# EAGLE design icyradio-exp-template (EAGLE 9.6.2)
CREVISION: 1; DESIGNER: Joao Silva
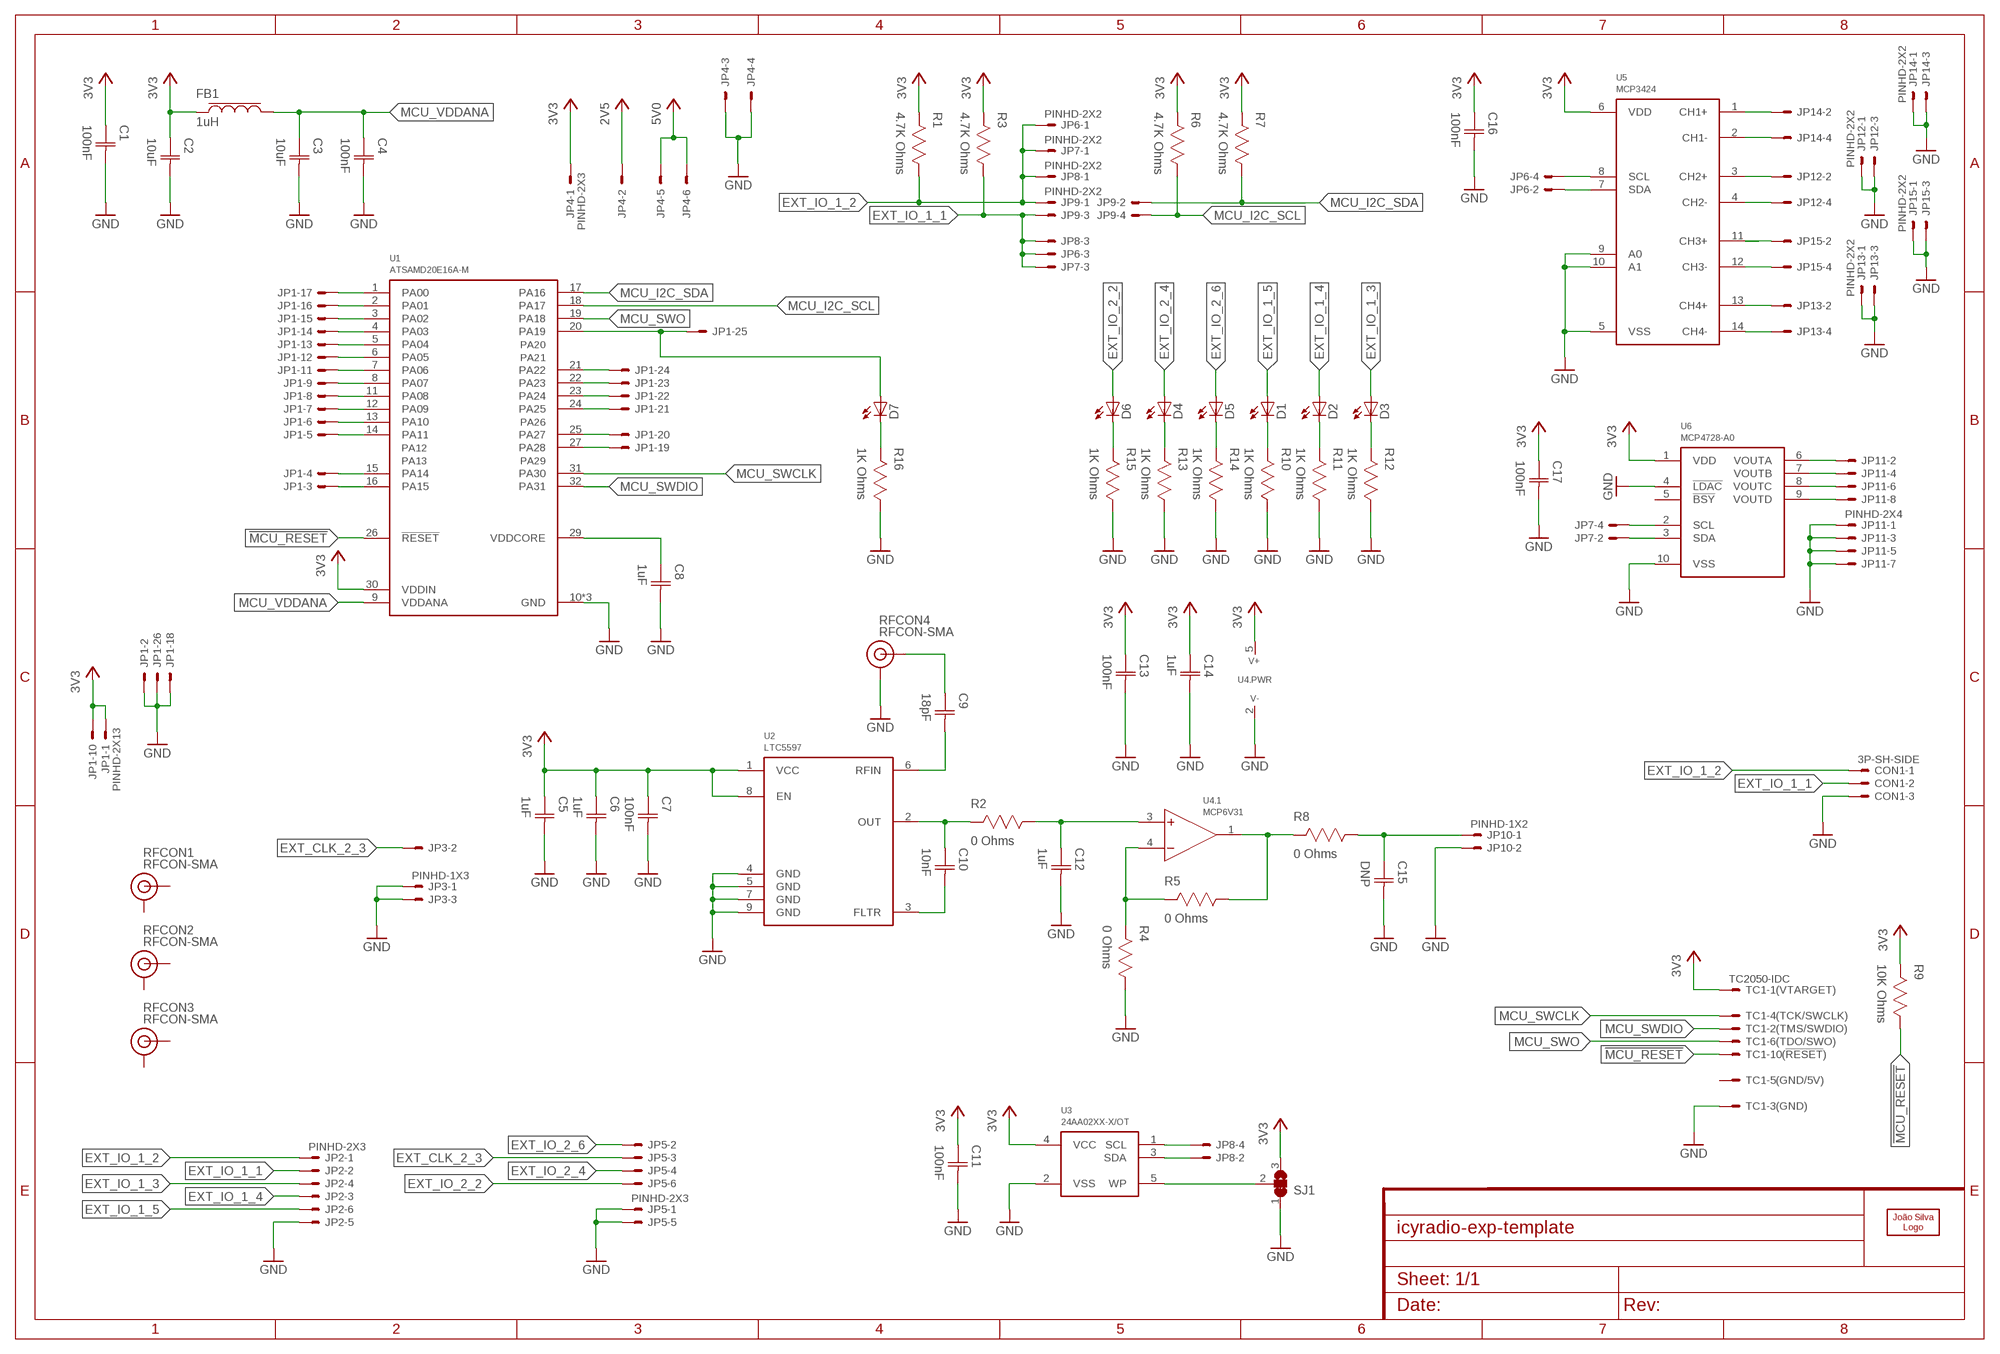
[diagram p0: schematic, sheet 1]

## Parts
C1  100nF  CAPACITOR-0402  [CAP0402]
C2  10uF  CAPACITOR-0402  [CAP0402]
C3  10uF  CAPACITOR-0402  [CAP0402]
C4  100nF  CAPACITOR-0402  [CAP0402]
C5  1uF  CAPACITOR-0402  [CAP0402]
C6  1uF  CAPACITOR-0402  [CAP0402]
C7  100nF  CAPACITOR-0402  [CAP0402]
C8  1uF  CAPACITOR-0402  [CAP0402]
C9  18pF  CAPACITOR-0402  [CAP0402]
C10  10nF  CAPACITOR-0402  [CAP0402]
C11  100nF  CAPACITOR-0402  [CAP0402]
C12  1uF  CAPACITOR-0402  [CAP0402]
C13  100nF  CAPACITOR-0402  [CAP0402]
C14  1uF  CAPACITOR-0402  [CAP0402]
C15  DNP  CAPACITOR-0402  [CAP0402]
C16  100nF  CAPACITOR-0402  [CAP0402]
C17  100nF  CAPACITOR-0402  [CAP0402]
CON1  3P-SH-SIDE  [SH-03-SIDE]
D1  LED0603  [0603]
D2  LED0603  [0603]
D3  LED0603  [0603]
D4  LED0603  [0603]
D5  LED0603  [0603]
D6  LED0603  [0603]
D7  LED0603  [0603]
FB1  1uH  FERRITE-0603  [IND0603]
JP1  PINHD-2X13  [2X13]
JP2  PINHD-2X3  [2X03]
JP3  PINHD-1X3  [1X03]
JP4  PINHD-2X3  [2X03]
JP5  PINHD-2X3  [2X03]
JP6  PINHD-2X2  [2X02]
JP7  PINHD-2X2  [2X02]
JP8  PINHD-2X2  [2X02]
JP9  PINHD-2X2  [2X02]
JP10  PINHD-1X2  [1X02]
JP11  PINHD-2X4  [2X04]
JP12  PINHD-2X2  [2X02]
JP13  PINHD-2X2  [2X02]
JP14  PINHD-2X2  [2X02]
JP15  PINHD-2X2  [2X02]
LOGO1  JSILVA-5MM  [JSILVA_5MM]
R1  4.7K Ohms  RESISTOR-0402  [RES0402]
R2  0 Ohms  RESISTOR-0402  [RES0402]
R3  4.7K Ohms  RESISTOR-0402  [RES0402]
R4  0 Ohms  RESISTOR-0402  [RES0402]
R5  0 Ohms  RESISTOR-0402  [RES0402]
R6  4.7K Ohms  RESISTOR-0402  [RES0402]
R7  4.7K Ohms  RESISTOR-0402  [RES0402]
R8  0 Ohms  RESISTOR-0402  [RES0402]
R9  10K Ohms  RESISTOR-0402  [RES0402]
R10  1K Ohms  RESISTOR-0402  [RES0402]
R11  1K Ohms  RESISTOR-0402  [RES0402]
R12  1K Ohms  RESISTOR-0402  [RES0402]
R13  1K Ohms  RESISTOR-0402  [RES0402]
R14  1K Ohms  RESISTOR-0402  [RES0402]
R15  1K Ohms  RESISTOR-0402  [RES0402]
R16  1K Ohms  RESISTOR-0402  [RES0402]
RFCON1  RFCON-SMA  [SMA]
RFCON2  RFCON-SMA  [SMA]
RFCON3  RFCON-SMA  [SMA]
RFCON4  RFCON-SMA  [SMA]
SJ1  SJ2CS  [SJ2C_S]
TC1  TC2050-IDC  [TC2050-IDC]
U1  ATSAMD20E16A-M  [QFN32]
U2  LTC5597  [DFN8_2X2]
U3  24AA02XX-X/OT  [SOT23-5]
U4  MCP6V31  [SOT23-5]
U5  MCP3424  [TSSOP14]
U6  MCP4728-A0  [MSOP10]

## Nets
2V5: JP4.2
3V3: C1.1(C1) C2.1(C1) C5.1(C1) C6.1(C1) C7.1(C1) C11.1(C1) C13.1(C1) C14.1(C1) C16.1(C1) C17.1(C1) FB1.1 JP1.1 JP1.10 JP4.1 R1.2 R3.2 R6.2 R7.2 R9.2 SJ1.3 TC1.1 U1.30(VDDIN) U2.1(VCC) U2.8(EN) U3.4(VCC) U4.5(.PWR:V+) U5.6(VDD) U6.1(VDD)
5V0: JP4.5 JP4.6
!MCU_RESET: R9.1 TC1.10 U1.26(!RESET)
ADC_C1_N: JP14.4 U5.2(CH1-)
ADC_C1_P: JP14.2 U5.1(CH1+)
ADC_C2_N: JP12.4 U5.4(CH2-)
ADC_C2_P: JP12.2 U5.3(CH2+)
ADC_C3_N: JP15.4 U5.12(CH3-)
ADC_C3_P: JP15.2 U5.11(CH3+)
ADC_C4_N: JP13.4 U5.14(CH4-)
ADC_C4_P: JP13.2 U5.13(CH4+)
ADC_I2C_SCL: JP6.4 U5.8(SCL)
ADC_I2C_SDA: JP6.2 U5.7(SDA)
DAC_I2C_SCL: JP7.4 U6.2(SCL)
DAC_I2C_SDA: JP7.2 U6.3(SDA)
DAC_VA: JP11.2 U6.6(VOUTA)
DAC_VB: JP11.4 U6.7(VOUTB)
DAC_VC: JP11.6 U6.8(VOUTC)
DAC_VD: JP11.8 U6.9(VOUTD)
EE_I2C_SCL: JP8.4 U3.1(SCL)
EE_I2C_SDA: JP8.2 U3.3(SDA)
EE_WP: SJ1.2 U3.5(WP)
EXT_CLK_2_3 [CPWG 50 Ohm Single-Ended]: JP3.2 JP5.3
EXT_IO_1_1: CON1.2 JP2.2 JP6.3 JP7.3 JP8.3 JP9.3 R3.1
EXT_IO_1_2: CON1.1 JP2.1 JP6.1 JP7.1 JP8.1 JP9.1 R1.1
EXT_IO_1_3: D3.A JP2.4
EXT_IO_1_4: D2.A JP2.3
EXT_IO_1_5: D1.A JP2.6
EXT_IO_2_2: D6.A JP5.6
EXT_IO_2_4: D4.A JP5.4
EXT_IO_2_6: D5.A JP5.2
GND: C1.2(C2) C2.2(C2) C3.2(C2) C4.2(C2) C5.2(C2) C6.2(C2) C7.2(C2) C8.2(C2) C11.2(C2) C12.2(C2) C13.2(C2) C14.2(C2) C15.2(C2) C16.2(C2) C17.2(C2) CON1.3 JP1.2 JP1.18 JP1.26 JP2.5 JP3.1 JP3.3 JP4.3 JP4.4 JP5.1 JP5.5 JP10.2 JP11.1 JP11.3 JP11.5 JP11.7 JP12.1 JP12.3 JP13.1 JP13.3 JP14.1 JP14.3 JP15.1 JP15.3 R4.1 R10.1 R11.1 R12.1 R13.1 R14.1 R15.1 R16.1 RFCON4.GND@0(GND) RFCON4.GND@1(GND) RFCON4.GND@2(GND) RFCON4.GND@3(GND) SJ1.1 TC1.3 U1.10(GND) U1.28(GND) U1.33(GND) U2.4(GND) U2.5(GND) U2.7(GND) U2.9(GND) U3.2(VSS) U4.2(.PWR:V-) U5.5(VSS) U5.9(A0) U5.10(A1) U6.4(!LDAC) U6.10(VSS)
MCU_I2C_SCL: JP9.4 R6.1 U1.18(PA17)
MCU_I2C_SDA: JP9.2 R7.1 U1.17(PA16)
MCU_SWCLK: TC1.4 U1.31(PA30)
MCU_SWDIO: TC1.2 U1.32(PA31)
MCU_SWO: TC1.6 U1.19(PA18)
MCU_VDDANA: C3.1(C1) C4.1(C1) FB1.2 U1.9(VDDANA)
N$1: C8.1(C1) U1.29(VDDCORE)
N$2: D1.C R10.2
N$3: D2.C R11.2
N$4: D3.C R12.2
N$5: D4.C R13.2
N$6: D5.C R14.2
N$7: D6.C R15.2
N$8: D7.C R16.2
N$14: R5.1 R8.2 U4.1(.1:OUT)
N$15: C10.2(C2) U2.3(FLTR)
N$16: C10.1(C1) R2.2 U2.2(OUT)
N$17: C12.1(C1) R2.1 U4.3(.1:+IN)
N$18: R4.2 R5.2 U4.4(.1:-IN)
N$19: C9.1(C1) RFCON4.SIGNAL
N$20: C9.2(C2) U2.6(RFIN)
N$21: C15.1(C1) JP10.1 R8.1
P0: JP1.17 U1.1(PA00)
P1: JP1.16 U1.2(PA01)
P2: JP1.15 U1.3(PA02)
P3: JP1.14 U1.4(PA03)
P4: JP1.13 U1.5(PA04)
P5: JP1.12 U1.6(PA05)
P6: JP1.11 U1.7(PA06)
P7: JP1.9 U1.8(PA07)
P8: JP1.8 U1.11(PA08)
P9: JP1.7 U1.12(PA09)
P10: JP1.6 U1.13(PA10)
P11: JP1.5 U1.14(PA11)
P14: JP1.4 U1.15(PA14)
P15: JP1.3 U1.16(PA15)
P19: D7.A JP1.25 U1.20(PA19)
P22: JP1.24 U1.21(PA22)
P23: JP1.23 U1.22(PA23)
P24: JP1.22 U1.23(PA24)
P25: JP1.21 U1.24(PA25)
P27: JP1.20 U1.25(PA27)
P28: JP1.19 U1.27(PA28)
Unconnected: RFCON1.GND@0(GND) RFCON1.GND@1(GND) RFCON1.GND@2(GND) RFCON1.GND@3(GND) RFCON1.SIGNAL RFCON2.GND@0(GND) RFCON2.GND@1(GND) RFCON2.GND@2(GND) RFCON2.GND@3(GND) RFCON2.SIGNAL RFCON3.GND@0(GND) RFCON3.GND@1(GND) RFCON3.GND@2(GND) RFCON3.GND@3(GND) RFCON3.SIGNAL TC1.5 TC1.7 TC1.8 TC1.9 U6.5(!BSY)

## Library data of the parts
C1-C17 = Capacitor:CAPACITOR
CON1 = JST:3P: Disconnectable Crimp style connector, 1.0mm pitch 3 contacts
D1-D7 = LED:LED
FB1 = Inductor:FERRITE
JP1 = Pin Header:PINHD-2X13: PIN HEADER
JP2 JP4 JP5 = Pin Header:PINHD-2X3: PIN HEADER
JP3 = Pin Header:PINHD-1X3: PIN HEADER
JP6-JP9 JP12-JP15 = Pin Header:PINHD-2X2: PIN HEADER
JP10 = Pin Header:PINHD-1X2: PIN HEADER
JP11 = Pin Header:PINHD-2X4: PIN HEADER
LOGO1 = Silkscreen:JS
R1-R16 = Resistor:RESISTOR
RFCON1-RFCON4 = RF Connector:RFCON
SJ1 = Solder Jumper:SJ2C
TC1 = TagConnect:TC2050-IDC
U1 = Microchip:ATSAMD2*-?
U2 = Analog Devices:LTC5597
U3 = Microchip:24AA02
U4 = Microchip:MCP6V31
U5 = Microchip:MCP3424
U6 = Microchip:MCP4728-A*

## Net classes
1 CPWG 50 Ohm Single-Ended: width 0.2 mm, clearance 0.127 mm to class 0, clearance 0.127 mm

## Board
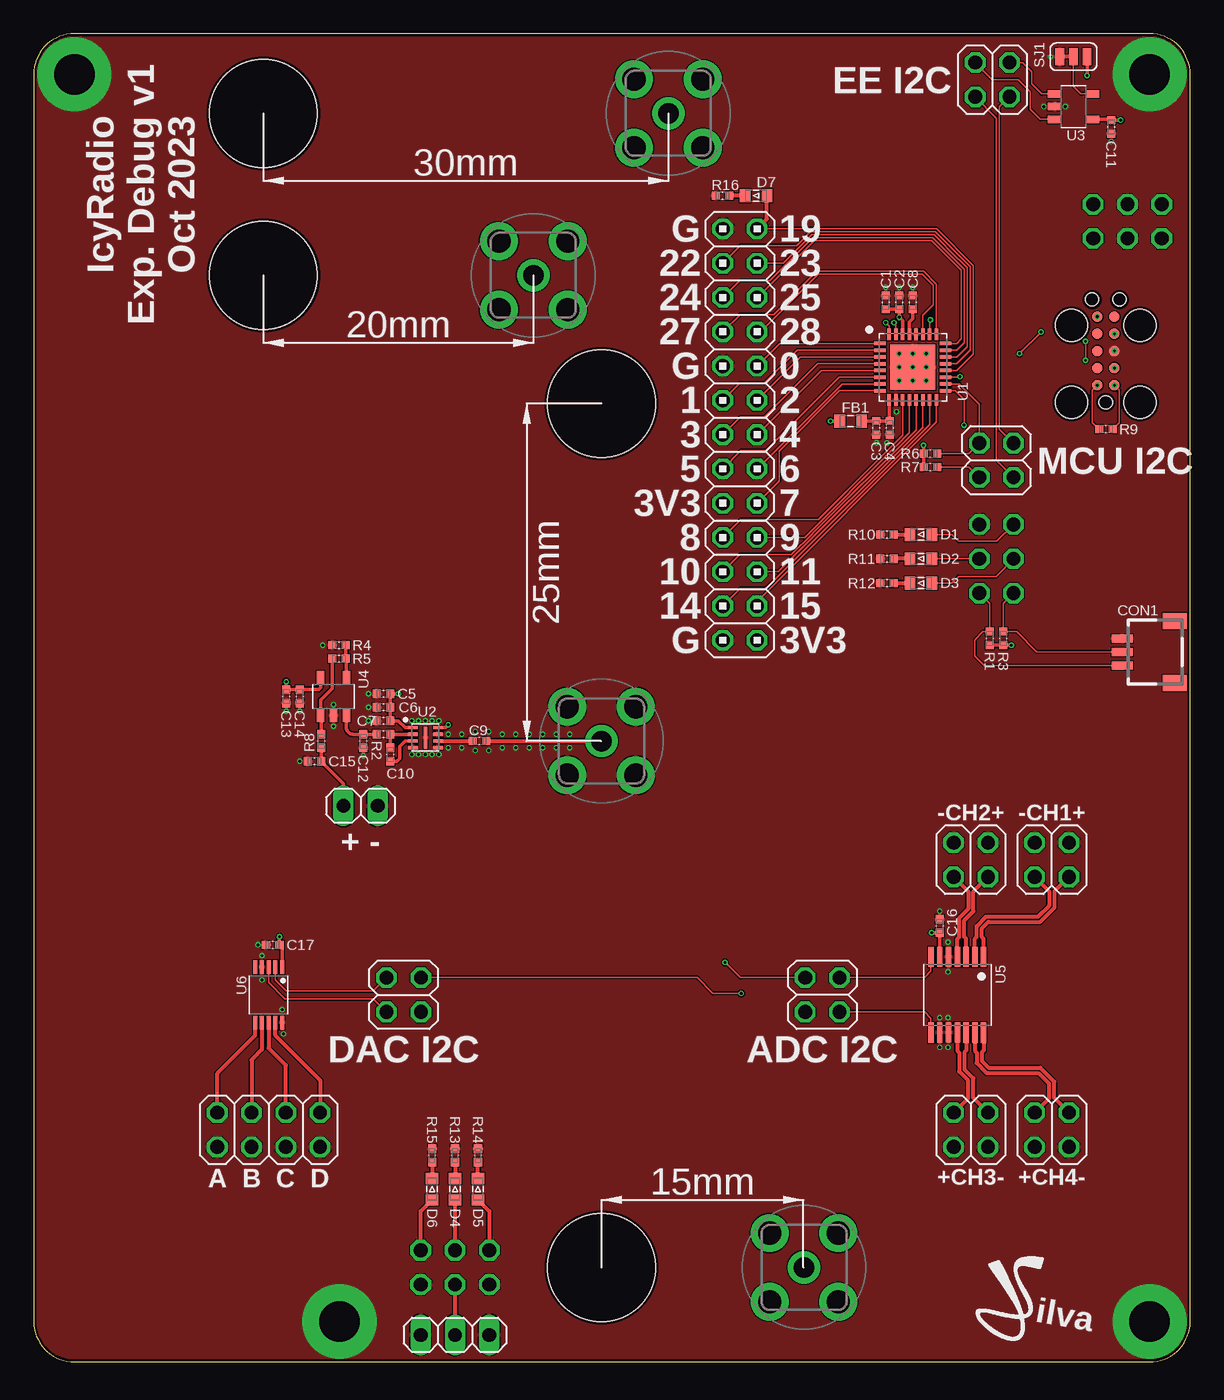
[diagram p1: board, top side]
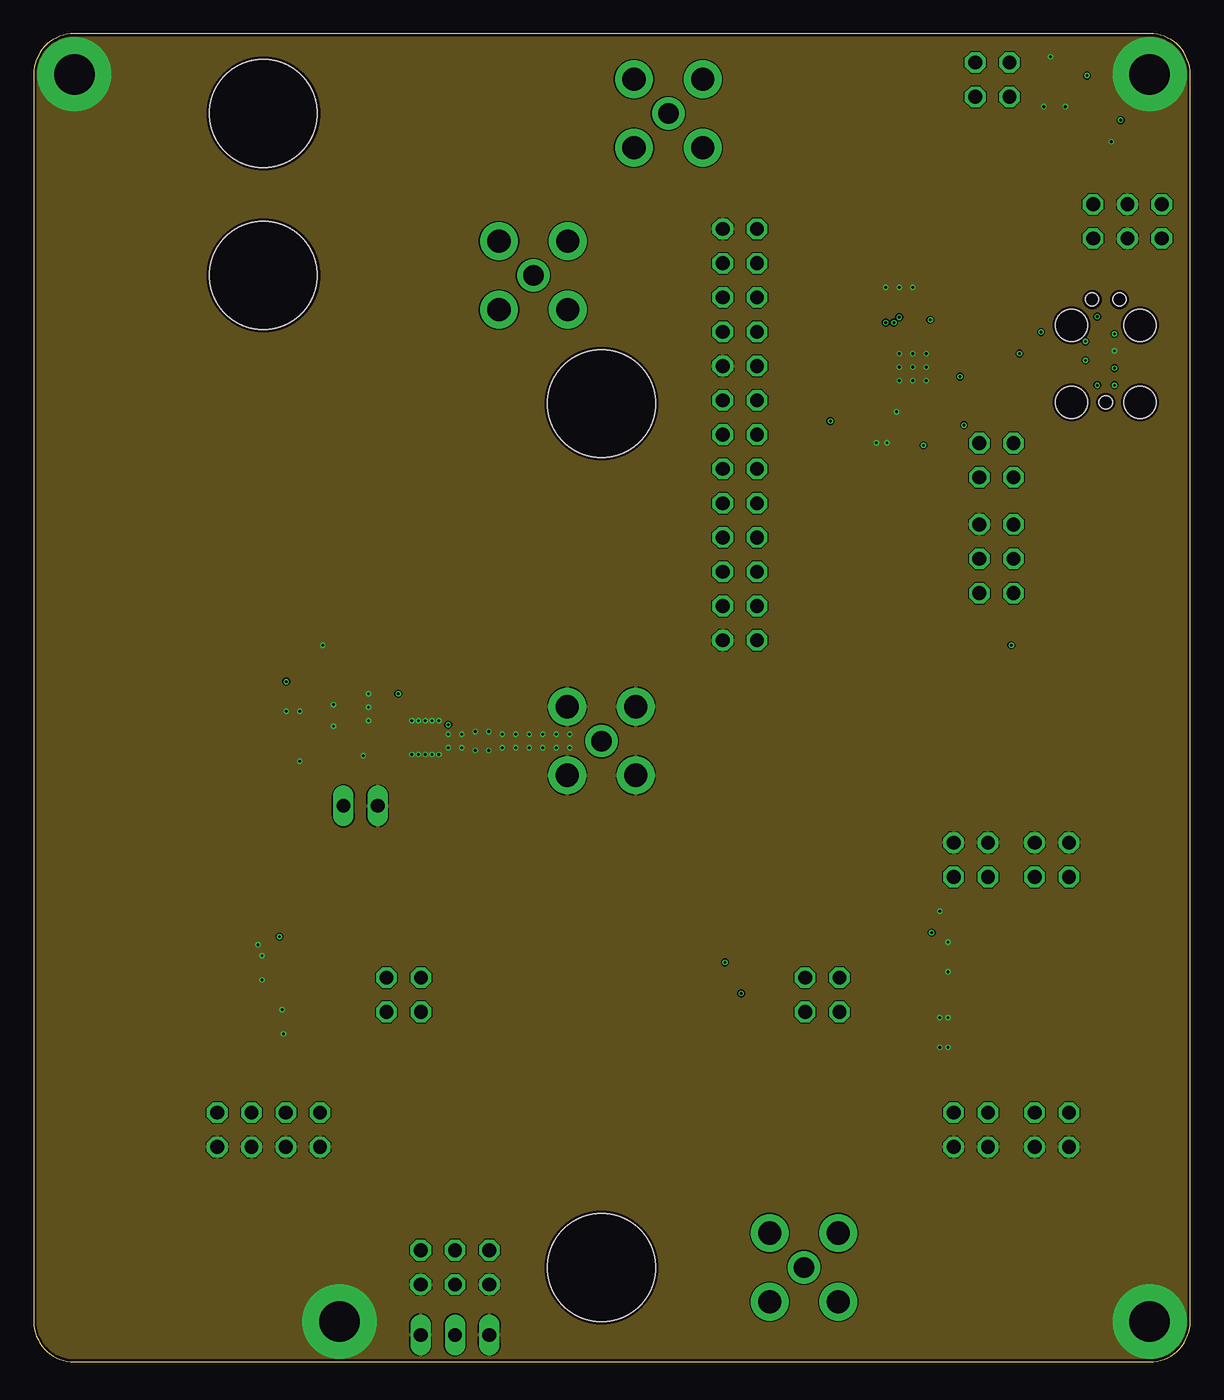
[diagram p2: board, inner layer Route2]
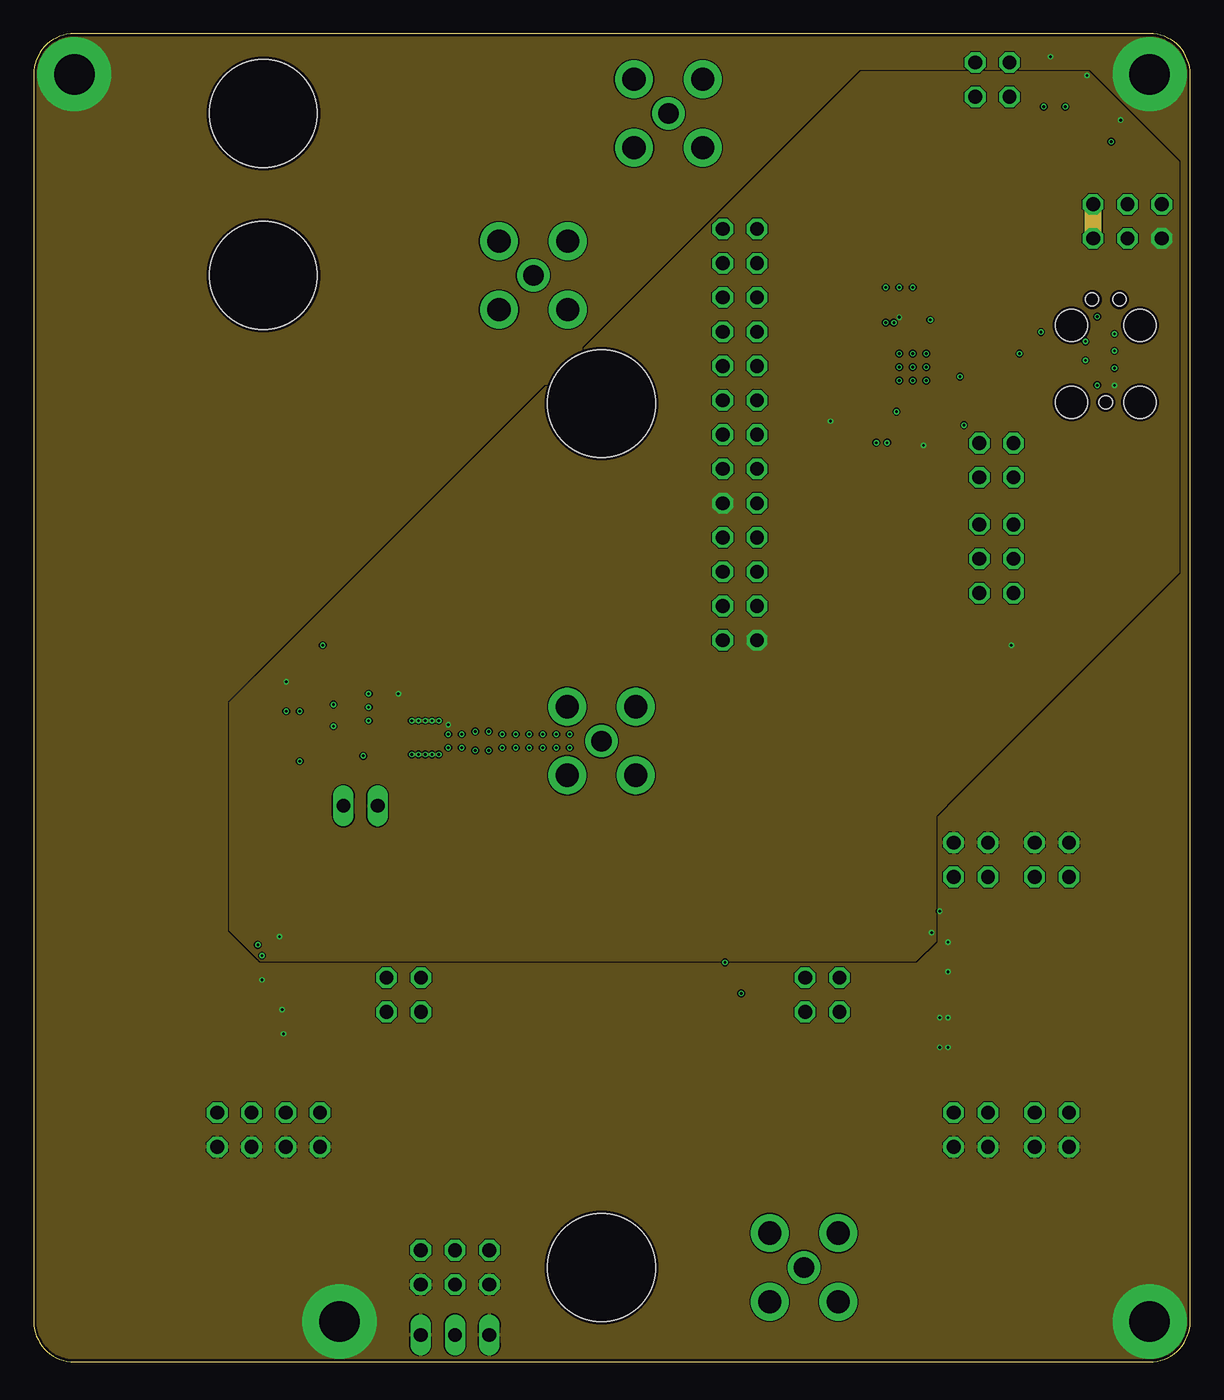
[diagram p3: board, inner layer Route15]
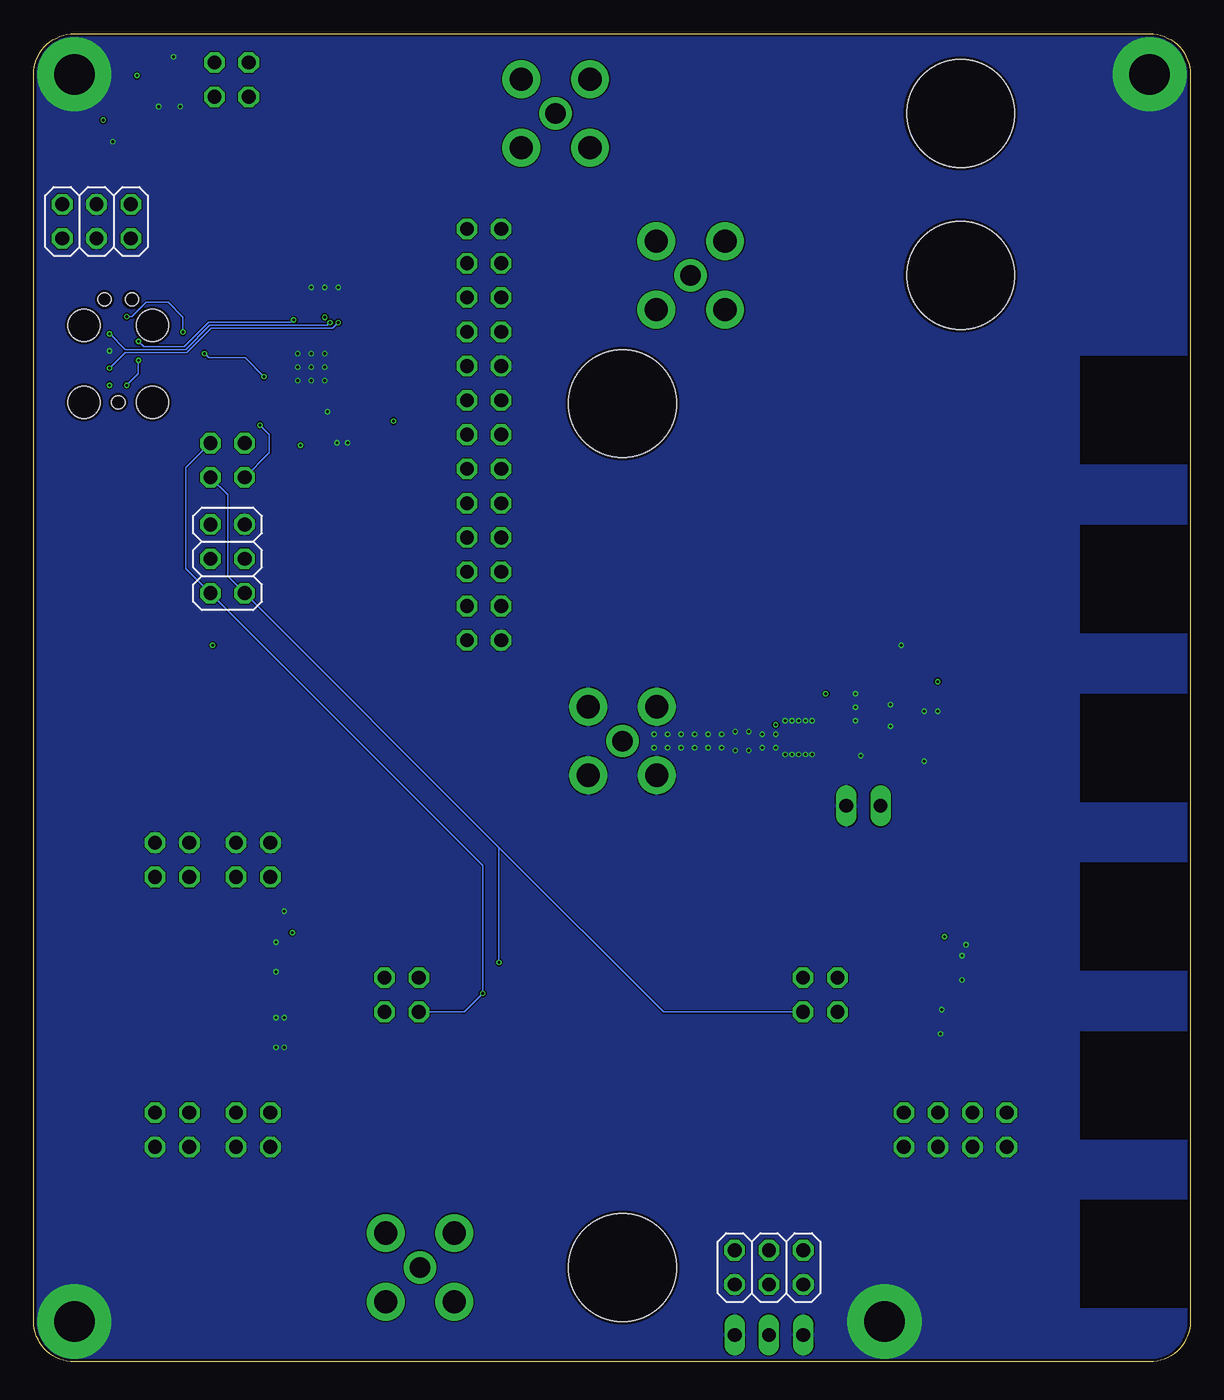
[diagram p4: board, bottom side, seen from below]

Size 85.65 x 98.4 mm. Coordinates in mm from the lower left corner, seen from the top.
Outline: 0,95.4 0,3 arc90 3,0 82.65,0 arc90 85.65,3 85.65,95.4 arc90 82.65,98.4 3,98.4 arc90 0,95.4
Copper layers (1+2*15+16): Top 0.035mm / dielectric 0.2mm / Route2 0.0175mm / dielectric 0.665mm / Route15 0.0175mm / dielectric 0.2mm / Bottom 0.035mm
Design rules "jlcpcb_4layer": minimum track width 3.5mil, minimum drill 0.2mm, track to track 3.5mil, track to pad 3.5mil, pad to pad 3.5mil, via to via 5mil, smd to smd 0mil, copper to edge 0.2mm, drill to drill 5mil, minimum pad ring 0.15mm, minimum via ring 0.1mm, stop-mask expansion 0.04mm, vias tented up to drill 10mm, thermal gap 3.5mil
Holes 8 mm at 42.05,71 17,80.5 17,92.5 42.05,7
bRestrict: area 0,4 to 8.2,12; area 0,16.5 to 8.2,24.5; area 0,29 to 8.2,37; area 0,41.5 to 8.2,49.5; area 0,54 to 8.2,62; area 0,66.5 to 8.2,74.5

### Footprints (pad centres in the part's own frame; a part is rotated, then mirrored left to right if it is on the bottom)
CAP0402 = smd 0.6 x 0.6: 1 -0.5,0; 2 0.5,0
SH-03-SIDE = smd 0.6 x 1.55: 1 -1,2.975; 2 0,2.975; 3 1,2.975 | smd 1.2 x 1.8: FIT@1 -2.3,-0.9; FIT@2 2.3,-0.9
0603 = smd 0.8 x 0.95: A 0.8,0; C -0.8,0
IND0603 = smd 0.8 x 0.95: 1 -0.8,0; 2 0.8,0
2X13 = drill 1.016 octagon: 1 -15.24,-1.27; 2 -15.24,1.27; 3 -12.7,-1.27; 4 -12.7,1.27; 5 -10.16,-1.27; 6 -10.16,1.27; 7 -7.62,-1.27; 8 -7.62,1.27; 9 -5.08,-1.27; 10 -5.08,1.27; 11 -2.54,-1.27; 12 -2.54,1.27; 13 0,-1.27; 14 0,1.27; 15 2.54,-1.27; 16 2.54,1.27; 17 5.08,-1.27; 18 5.08,1.27; 19 7.62,-1.27; 20 7.62,1.27; 21 10.16,-1.27; 22 10.16,1.27; 23 12.7,-1.27; 24 12.7,1.27; 25 15.24,-1.27; 26 15.24,1.27
2X03 = drill 1.016 octagon: 1 -2.54,-1.27; 2 -2.54,1.27; 3 0,-1.27; 4 0,1.27; 5 2.54,-1.27; 6 2.54,1.27
1X03 = drill 1.016 long: 1 -2.54,0; 2 0,0; 3 2.54,0
2X02 = drill 1.016 octagon: 1 -1.27,-1.27; 2 -1.27,1.27; 3 1.27,-1.27; 4 1.27,1.27
1X02 = drill 1.016 long: 1 -1.27,0; 2 1.27,0
2X04 = drill 1.016 octagon: 1 -3.81,-1.27; 2 -3.81,1.27; 3 -1.27,-1.27; 4 -1.27,1.27; 5 1.27,-1.27; 6 1.27,1.27; 7 3.81,-1.27; 8 3.81,1.27
RES0402 = smd 0.6 x 0.6: 1 -0.5,0; 2 0.5,0
SMA = drill 1.72 pad 2.8: GND@0 -2.54,2.54; GND@1 2.54,2.54; GND@2 -2.54,-2.54; GND@3 2.54,-2.54 | drill 1.52 pad 2.4: SIGNAL 0,0
SJ2C_S = smd 0.635 x 1.27: 1 -1.016,0; 2 0,0; 3 1.016,0
TC2050-IDC = smd 0.787 x 0.787: 1 -2.54,-0.635; 2 -1.27,-0.635; 3 0,-0.635; 4 1.27,-0.635; 5 2.54,-0.635; 6 2.54,0.635; 7 1.27,0.635; 8 0,0.635; 9 -1.27,0.635; 10 -2.54,0.635 | hole 0.991: -3.81,0; 3.81,1.016; 3.81,-1.016 | hole 2.375: -3.81,2.54; -3.81,-2.54; 1.905,2.54; 1.905,-2.54
QFN32 = smd 0.86 x 0.26: 1 -2.435,1.75; 2 -2.435,1.25; 3 -2.435,0.75; 4 -2.435,0.25; 5 -2.435,-0.25; 6 -2.435,-0.75; 7 -2.435,-1.25; 8 -2.435,-1.75; 17 2.435,-1.75; 18 2.435,-1.25; 19 2.435,-0.75; 20 2.435,-0.25; 21 2.435,0.25; 22 2.435,0.75; 23 2.435,1.25; 24 2.435,1.75 | smd 0.26 x 0.86: 9 -1.75,-2.435; 10 -1.25,-2.435; 11 -0.75,-2.435; 12 -0.25,-2.435; 13 0.25,-2.435; 14 0.75,-2.435; 15 1.25,-2.435; 16 1.75,-2.435; 25 1.75,2.435; 26 1.25,2.435; 27 0.75,2.435; 28 0.25,2.435; 29 -0.25,2.435; 30 -0.75,2.435; 31 -1.25,2.435; 32 -1.75,2.435 | smd 3.3 x 3.3: 33 0,0
DFN8_2X2 = smd 0.7 x 0.25: 1 -0.925,0.75; 2 -0.925,0.25; 3 -0.925,-0.25; 4 -0.925,-0.75; 5 0.925,-0.75; 6 0.925,-0.25; 7 0.925,0.25; 8 0.925,0.75 | smd 0.25 x 1.6: 9 0,0
SOT23-5 = smd 1 x 0.55: 1 -1.4,0.95; 2 -1.4,0; 3 -1.4,-0.95; 4 1.4,-0.95; 5 1.4,0.95
TSSOP14 = smd 0.4 x 1.5: 1 -1.95,-2.8; 2 -1.3,-2.8; 3 -0.65,-2.8; 4 0,-2.8; 5 0.65,-2.8; 6 1.3,-2.8; 7 1.95,-2.8; 8 1.95,2.8; 9 1.3,2.8; 10 0.65,2.796; 11 0,2.796; 12 -0.65,2.8; 13 -1.3,2.8; 14 -1.95,2.8
MSOP10 = smd 0.3 x 1: 1 -1,-2.05; 2 -0.5,-2.05; 3 0,-2.05; 4 0.5,-2.05; 5 1,-2.05; 6 1,2.05; 7 0.5,2.05; 8 0,2.05; 9 -0.5,2.05; 10 -1,2.05

### Placement (x,y rotation side)
C1  63.1,78.5 90 top
C2  64.1,78.5 90 top
C3  62.4,69.2 270 top
C4  63.4,69.2 270 top
C5  25.9,49.5 180 top
C6  25.9,48.5 180 top
C7  25.9,47.5 180 top
C8  65.1,78.5 90 top
C9  33,46 180 top
C10  26.4,45 270 top
C11  79.8,91.5 270 top
C12  24.4,46 270 top
C13  18.7,49.3 270 top
C14  19.7,49.3 270 top
C15  20.8,44.5 180 top
C16  67.1,32.3 90 top
C17  17.7,30.9 180 top
CON1  83.6,52.6 90 top
D1  65.7,61.3 0 top
D2  65.7,59.5 0 top
D3  65.7,57.7 0 top
D4  31.2,12.8 270 top
D5  32.9,12.8 270 top
D6  29.5,12.8 270 top
D7  53.5,86.4 0 top
FB1  60.5,69.7 0 top
JP1  52.3,68.7 90 top
JP2  71.3,59.5 90 bottom
JP3  31.2,2 0 top
JP4  81,84.5 0 bottom
JP5  31.2,7 0 bottom
JP6  58.4,27.2 270 top
JP7  27.4,27.2 90 top
JP8  71,95 0 top
JP9  71.3,66.8 90 top
JP10  24.2,41.2 0 top
JP11  17.4,17.2 0 top
JP12  69.4,37.2 180 top
JP13  75.4,17.2 0 top
JP14  75.4,37.2 180 top
JP15  69.4,17.2 0 top
LOGO1  75,8 0 top
R1  70.8,53.6 270 top
R2  25.9,46.5 0 top
R3  71.8,53.6 270 top
R4  22.6,53.1 0 top
R5  22.6,52.1 0 top
R6  66.4,67.3 180 top
R7  66.4,66.3 180 top
R8  21.3,46 90 top
R9  79.4,69.1 0 top
R10  63.2,61.3 0 top
R11  63.2,59.5 0 top
R12  63.2,57.7 0 top
R13  31.2,15.3 270 top
R14  32.9,15.3 270 top
R15  29.5,15.3 270 top
R16  51,86.4 0 top
RFCON1  37,80.5 0 top
RFCON2  47,92.5 0 top
RFCON3  57.05,7 0 top
RFCON4  42.05,46 0 top
SJ1  77,96.7 0 top
TC1  79.4,74.9 90 top
U1  65.1,73.7 0 top
U2  29,46.25 0 top
U3  77,93 0 top
U4  22.2,49.3 90 top
U5  68.4,27.2 180 top
U6  17.4,27.2 180 top

### Tracks (layer width: path | path; a pad name or v marks a point on that pad's centre or on a via)
3V3  (via drill 0.2)
  Top 0.127: R9.2 80.4,69.6 80.4,72 v80.03,72.36
  Top 0.254: R1.2 R3.2 v72.4,53.1 | U3.4 79.75,92.05 C11.1 v80.5,92 | SJ1.3 78.02,95.32 v78,95.3 | R7.2 R6.2 v65.9,67.9 | U6.1 18.4,30.7 C17.1 v18.2,31.5 | U5.6 C16.1 v66.5,31.8 | U2.1 27.5,47 27,47.5 C7.1 C6.1 C5.1 v27,49.5 | U2.8 30.5,47 v30.7,47.2 | U4.5 21.25,49.95 21.1,49.8 C14.1 C13.1 v18.7,50.4 | U1.30 64.35,77.15 v64.1,77.4 C2.1 C1.1 | FB1.1 v59,69.7
  pour Route15 (no thermals): 14.5,32 16.8,29.7 29,29.7 65.3,29.7 66.8,31.2 66.8,40.5 68.4,42.1 84.8,58.5 84.8,85 84.8,88.9 78.1,95.6 61.3,95.6 20.3,54.6 14.5,48.8
5V0
  Route15 1.27: JP4.5 JP4.6
!MCU_RESET  (via drill 0.2)
  Top 0.127: U1.26 66.35,77.15 v66.4,77.2 | v77.9,75.6 v77.9,74.2 | R9.1 78.4,69.6 78.4,72 TC1.10
  Bottom 0.127: v66.4,77.2 66.58,77.02 72.69,77.02 74.49,75.22 77.52,75.22 v77.9,75.6 | v77.9,74.2 77.9,73.22 TC1.10
  other vias: 78.77,72.36
ADC_C1_N
  Top 0.3: U5.2 69.7,31.35 69.83,31.48 69.83,32.28 70.54,32.99 74.39,32.99 75.2,33.8 75.2,34.86 JP14.4
ADC_C1_P
  Top 0.3: U5.1 70.35,31.35 70.22,31.48 70.22,32.12 70.7,32.6 74.55,32.6 75.59,33.64 75.59,34.85 JP14.2
ADC_C2_N
  Top 0.3: U5.4 68.4,31.35 68.53,31.48 68.53,32.88 69.2,33.55 69.2,34.86 JP12.4
ADC_C2_P
  Top 0.3: U5.3 69.05,31.35 68.92,31.48 68.92,32.72 69.59,33.39 69.59,34.85 JP12.2
ADC_C3_N
  Top 0.3: U5.12 69.05,23.05 68.92,22.92 68.92,21.68 69.59,21.01 69.59,19.55 JP15.4
ADC_C3_P
  Top 0.3: U5.11 68.4,23.05 68.53,22.92 68.53,21.52 69.2,20.85 69.2,19.54 JP15.2
ADC_C4_N
  Top 0.3: U5.14 70.35,23.05 70.22,22.92 70.22,22.3 70.72,21.8 74.55,21.8 75.59,20.76 75.59,19.55 JP13.4
ADC_C4_P
  Top 0.3: U5.13 69.7,23.05 69.83,22.92 69.83,22.14 70.56,21.41 74.39,21.41 75.2,20.6 75.2,19.54 JP13.2
ADC_I2C_SCL
  Top 0.127: U5.8 66.45,25.45 65.97,25.93 JP6.4
ADC_I2C_SDA
  Top 0.127: U5.7 66.45,28.95 65.97,28.47 JP6.2
DAC_I2C_SCL
  Top 0.127: U6.2 17.9,28.3 18.7,27.5 25.16,27.5 JP7.4
DAC_I2C_SDA
  Top 0.127: U6.3 17.4,28.1 18.6,26.9 25.16,26.9 JP7.2
DAC_VA
  Top 0.3: JP11.2 13.59,21.37 16.4,24.18 U6.6
DAC_VB
  Top 0.3: U6.7 16.9,23.14 16.13,22.37 JP11.4
DAC_VC
  Top 0.3: JP11.6 18.67,21.97 17.4,23.24 U6.8
DAC_VD
  Top 0.3: JP11.8 21.21,20.87 17.9,24.18 U6.9
EE_I2C_SCL
  Top 0.127: U3.1 74.65,93.95 73.9,94.7 73.9,95.6 73.23,96.27 JP8.4
EE_I2C_SDA
  Top 0.127: U3.3 74.55,92.05 73.8,92.8 73.8,94.1 72.9,95 71,95 JP8.2
EE_WP
  Top 0.127: U3.5 77.55,93.95 77,94.5 SJ1.2
EXT_CLK_2_3
  Top 0.3: JP3.2 JP5.3
EXT_IO_1_1  (via drill 0.2)
  Top 0.127: JP2.2 71.8,56.19 R3.1 72.8,54.1 74.3,52.6 CON1.2 | JP9.3 71.52,69.12 71.52,92.98 JP8.3 | v52.4,27.3 50.3,27.3 49.13,28.47 JP7.3
  Bottom 0.127: JP9.3 74.4,66.24 74.4,58.79 JP2.2 52.4,36.79 v52.4,27.3 53.77,25.93 JP6.3
EXT_IO_1_2  (via drill 0.2)
  Top 0.127: JP2.1 70.8,56.19 R1.1 70.3,54.1 69.7,53.5 69.7,52.3 70.4,51.6 CON1.1 | JP9.1 71.3,66.8 71.3,92.16 JP8.1 | JP6.1 52.33,28.47 v51.2,29.6
  Bottom 0.127: JP9.1 71.3,64.26 71.3,58.23 JP2.1 51.2,38.13 | 51.2,38.13 39,25.93 JP7.1 | v51.2,29.6 51.2,38.13
EXT_IO_1_3
  Top 0.127: D3.A 68,57.7 68.5,58.2 71.27,58.2 JP2.4
EXT_IO_1_4
  Top 0.127: D2.A JP2.3
EXT_IO_1_5
  Top 0.127: D1.A 68,61.3 68.5,60.8 71.33,60.8 JP2.6
EXT_IO_2_2
  Top 0.3: JP5.6 28.66,11.16 D6.A
EXT_IO_2_4
  Top 0.3: JP5.4 D4.A
EXT_IO_2_6
  Top 0.3: D5.A 33.74,11.16 JP5.2
GND  (via drill 0.2, 3 pad 5.5)
  other vias: 82.65,3 82.65,95.4 3,95.4 22.65,3 80.03,74.9 67.1,25.5 67.7,25.5 67.7,31.1 67.7,28.9 67.1,33.4 18.5,24.3 18.4,26.1 16.9,30.1 16.6,30.9 16.9,28.3 67.1,23.3 67.7,23.3 18.7,48.2 19.7,48.2 22.2,48.7 22.2,47.1 21.4,53.1 24.8,49.5 24.8,48.5 24.8,47.5 24.4,44.9 19.7,44.5 28,45 28.5,45 29,45 29.5,45 30,45 30.7,45.5 30.7,46.5 28,47.5 28.5,47.5 29,47.5 29.5,47.5 30,47.5 31.7,45.5 31.7,46.5 32.7,45.3 32.7,46.7 33.7,45.3 33.7,46.7 34.7,45.5 34.7,46.5 35.7,45.5 35.7,46.5 36.7,45.5 36.7,46.5 37.7,45.5 37.7,46.5 38.7,45.5 38.7,46.5 39.7,45.5 39.7,46.5 63.9,70.4 63.2,68.1 62.4,68.1 63.1,79.6 64.1,79.6 65.1,79.6 75.3,96.7 74.8,93 76.4,93 79.8,90.4 64.1,74.7 65.1,74.7 66.1,74.7 66.1,73.7 66.1,72.7 65.1,72.7 64.1,72.7 64.1,73.7 65.1,73.7
  pour Bottom (rank 6): -7.9,102.4 89.65,102.4 89.65,-4 -7.9,-4
  pour Top (rank 6): -1,99.4 86.65,99.4 86.65,-1 -1,-1
  pour Route2 (rank 6): -2,100.4 87.65,100.4 87.65,-2 -2,-2
  pour Route15 (rank 6): -3,101.4 88.65,101.4 88.65,-3 -3,-3
MCU_I2C_SCL
  Top 0.127: R6.1 69.26,67.3 JP9.4 70.03,70.97 68.55,72.45 U1.18
MCU_I2C_SDA  (via drill 0.2)
  Top 0.127: JP9.2 69.26,66.3 R7.1 | U1.17 68.25,71.95 68.9,71.3 v68.9,69.4
  Bottom 0.127: v68.9,69.4 68.2,68.7 68.2,67.36 JP9.2
MCU_SWCLK  (via drill 0.2)
  Top 0.127: U1.31 63.85,76.85 v63.7,77
  Bottom 0.127: v63.7,77 63.9,76.8 72.6,76.8 74.4,75 78.86,75 v80.03,76.17
MCU_SWDIO  (via drill 0.2)
  Top 0.127: U1.32 63.35,76.75 v63.1,77
  Bottom 0.127: v63.1,77 63.52,76.58 72.51,76.58 74.31,74.78 78.88,74.78 v80.03,73.63
MCU_SWO  (via drill 0.2)
  Top 0.127: U1.19 68.55,72.95 v68.6,73 | v73,74.7 v74.6,76.3
  Bottom 0.127: v68.6,73 70,74.4 72.7,74.4 v73,74.7 | v74.6,76.3 74.6,77.4 75.7,78.5 77.32,78.5 78.38,77.44 TC1.6
  other vias: 78.77,77.44
MCU_VDDANA
  Top 0.254: FB1.2 C3.1 C4.1 63.35,69.75 U1.9
N$1
  Top 0.254: U1.29 64.85,77.05 65.1,77.3 C8.1
N$2
  Top 0.3: R10.2 D1.C
N$3
  Top 0.3: D2.C R11.2
N$4
  Top 0.3: R12.2 D3.C
N$5
  Top 0.3: R13.2 D4.C
N$6
  Top 0.3: D5.C R14.2
N$7
  Top 0.3: R15.2 D6.C
N$8
  Top 0.3: D7.C R16.2
N$14
  Top 0.254: R8.2 21.3,47.85 U4.1 21.25,49.05 22.1,49.9 R5.1
N$15
  Top 0.254: U2.3 27.5,46 27.1,45.6 27.1,44.7 26.9,44.5 C10.2
N$16
  Top 0.254: C10.1 R2.2 U2.2
N$17
  Top 0.254: R2.1 C12.1 23.65,46.5 arc-90 23.15,47 U4.3
N$18
  Top 0.254: U4.4 23.15,52.05 R5.2 R4.2
N$19
  Top 0.3: C9.1 RFCON4.SIGNAL
N$20
  Top 0.3: U2.6 C9.2
N$21
  Top 0.254: R8.1 C15.1 22.93,42.87 JP10.1
P0
  Top 0.127: U1.1 55.24,75.45 JP1.17
P1
  Top 0.127: U1.2 56.55,74.95 54.1,72.5 52.29,72.5 JP1.16
P2
  Top 0.127: U1.3 56.78,74.45 JP1.15
P3
  Top 0.127: U1.4 58.05,73.95 54.1,70 52.33,70 JP1.14
P4
  Top 0.127: U1.5 58.32,73.45 JP1.13
P5
  Top 0.127: U1.6 59.65,72.95 54.2,67.5 52.37,67.5 JP1.12
P6
  Top 0.127: U1.7 59.86,72.45 JP1.11
P7
  Top 0.127: U1.8 59.66,71.95 55.2,67.48 55.2,65.25 JP1.9
P8
  Top 0.127: U1.11 64.35,68.65 58.1,62.4 52.35,62.4 JP1.8
P9
  Top 0.127: U1.12 64.85,68.84 63.9,67.9 63.8,67.8 57.09,61.08 JP1.7
P10
  Top 0.127: U1.13 65.35,69.04 57.7,61.4 57.66,61.34 56.11,59.8 52.29,59.8 JP1.6
P11
  Top 0.127: U1.14 65.85,69.23 55.16,58.54 JP1.5
P14
  Top 0.127: U1.15 66.35,69.43 54.22,57.3 52.33,57.3 JP1.4
P15
  Top 0.127: U1.16 66.85,69.62 53.57,56.34 JP1.3
P19
  Top 0.127: JP1.25 66.86,83.94 69.56,81.24 69.56,74.66 68.35,73.45 U1.20
  Top 0.3: JP1.25 54.3,84.67 D7.A
P22
  Top 0.127: JP1.24 52.33,82.7 56.5,82.7 57.52,83.72 66.77,83.72 69.35,81.15 69.35,76.5 69.35,76.4 69.35,74.95 68.35,73.95 U1.21
P23
  Top 0.127: JP1.23 55.51,81.4 57.61,83.51 66.68,83.51 68.44,81.75 68.57,81.62 69.13,81.06 69.13,75.23 68.35,74.45 U1.22
P24
  Top 0.127: U1.23 68.35,74.95 68.92,75.52 68.92,80.97 66.59,83.29 57.7,83.29 54.51,80.1 52.27,80.1 JP1.22
P25
  Top 0.127: U1.24 68.35,75.45 68.7,75.8 68.7,80.88 66.5,83.08 64.6,83.08 64.5,83.08 57.79,83.08 JP1.21
P27
  Top 0.127: U1.25 66.85,79.85 65.9,80.8 58,80.8 54.8,77.6 52.31,77.6 JP1.20
P28
  Top 0.127: U1.27 65.85,77.55 66.63,78.33 66.63,79.76 65.81,80.58 58.09,80.58 53.83,76.32 JP1.19

### Text on the board
tPlace: EE I2C | IcyRadio / Exp. Debug v1 / Oct 2023 | G | 19 | 22 | 23 | 24 | 25 | 27 | 28 | G | 0 | 1 | 2 | 3 | 4 | MCU I2C | 5 | 6 | 3V3 | 7 | 8 | 9 | 10 | 11 | 14 | 15 | G | 3V3 | -CH2+ | -CH1+ | + - | DAC I2C | ADC I2C | A B C D | +CH3- | +CH4-